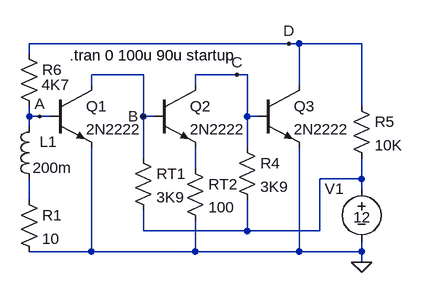
[diagram p0: schematic GenMulFor.asc]
GenMulFor.asc, the LTspice schematic file:
Version 4
SHEET 1 880 680
WIRE -32 112 -32 96
WIRE -32 208 -32 192
WIRE -32 224 -32 208
WIRE -32 336 -32 304
WIRE -16 208 -32 208
WIRE 0 208 -16 208
WIRE 64 160 64 144
WIRE 64 416 -32 416
WIRE 64 416 64 256
WIRE 144 144 64 144
WIRE 144 208 144 144
WIRE 144 272 144 208
WIRE 144 384 144 352
WIRE 160 208 144 208
WIRE 224 160 224 144
WIRE 224 288 224 256
WIRE 224 416 64 416
WIRE 224 416 224 368
WIRE 288 144 224 144
WIRE 304 144 288 144
WIRE 304 208 304 144
WIRE 304 256 304 208
WIRE 304 384 144 384
WIRE 304 384 304 336
WIRE 320 208 304 208
WIRE 368 96 -32 96
WIRE 384 96 368 96
WIRE 384 160 384 96
WIRE 384 416 224 416
WIRE 384 416 384 256
WIRE 416 384 304 384
WIRE 416 384 416 304
WIRE 480 96 384 96
WIRE 480 192 480 96
WIRE 480 304 416 304
WIRE 480 304 480 272
WIRE 480 320 480 304
WIRE 480 416 384 416
WIRE 480 416 480 400
WIRE 480 432 480 416
FLAG 480 432 0
FLAG -16 208 A
FLAG 144 208 B
FLAG 288 144 C
FLAG 368 96 D
SYMBOL npn 0 160 R0
SYMATTR InstName Q1
SYMATTR Value 2N2222
SYMBOL ind -16 208 M0
WINDOW 0 -27 39 Left 0
WINDOW 3 -50 79 Left 0
SYMATTR InstName L1
SYMATTR Value 200m
SYMBOL res -48 320 R0
SYMATTR InstName R1
SYMATTR Value 10
SYMATTR SpiceLine tol=1 pwr=0.1
SYMBOL npn 160 160 R0
SYMATTR InstName Q2
SYMATTR Value 2N2222
SYMBOL res 128 256 R0
SYMATTR InstName RT1
SYMATTR Value 3K9
SYMATTR SpiceLine tol=1 pwr=0.1
SYMBOL res 208 272 R0
SYMATTR InstName RT2
SYMATTR Value 100
SYMATTR SpiceLine tol=1 pwr=0.1
SYMBOL npn 320 160 R0
SYMATTR InstName Q3
SYMATTR Value 2N2222
SYMBOL res 288 240 R0
SYMATTR InstName R4
SYMATTR Value 3K9
SYMATTR SpiceLine tol=1 pwr=0.1
SYMBOL voltage 480 304 R0
WINDOW 0 -57 15 Left 0
WINDOW 3 -13 59 Left 0
WINDOW 123 0 0 Left 0
SYMATTR InstName V1
SYMATTR Value 12
SYMATTR SpiceLine Rser=.1 Cpar=100n
SYMBOL res 464 176 R0
SYMATTR InstName R5
SYMATTR Value 10K
SYMATTR SpiceLine tol=1 pwr=0.1
SYMBOL res -48 96 R0
WINDOW 3 35 63 Left 0
SYMATTR InstName R6
SYMATTR Value 4K7
SYMATTR SpiceLine tol=1 pwr=0.1
TEXT 30 114 Left 0 !.tran 0 100u 90u startup

The netlist it stands for:
* GenMulFor.asc
Q1 B A 0 0 2N2222
L1 A N001 200m
R1 N001 0 10 tol=1 pwr=0.1
Q2 C B N003 0 2N2222
RT1 B N002 3K9 tol=1 pwr=0.1
RT2 N003 0 100 tol=1 pwr=0.1
Q3 D C 0 0 2N2222
R4 C N002 3K9 tol=1 pwr=0.1
V1 N002 0 12 Rser=.1 Cpar=100n
R5 D N002 10K tol=1 pwr=0.1
R6 D A 4K7 tol=1 pwr=0.1
.model NPN NPN
.model PNP PNP
.lib standard.bjt
.tran 0 100u 90u startup
.backanno
.end